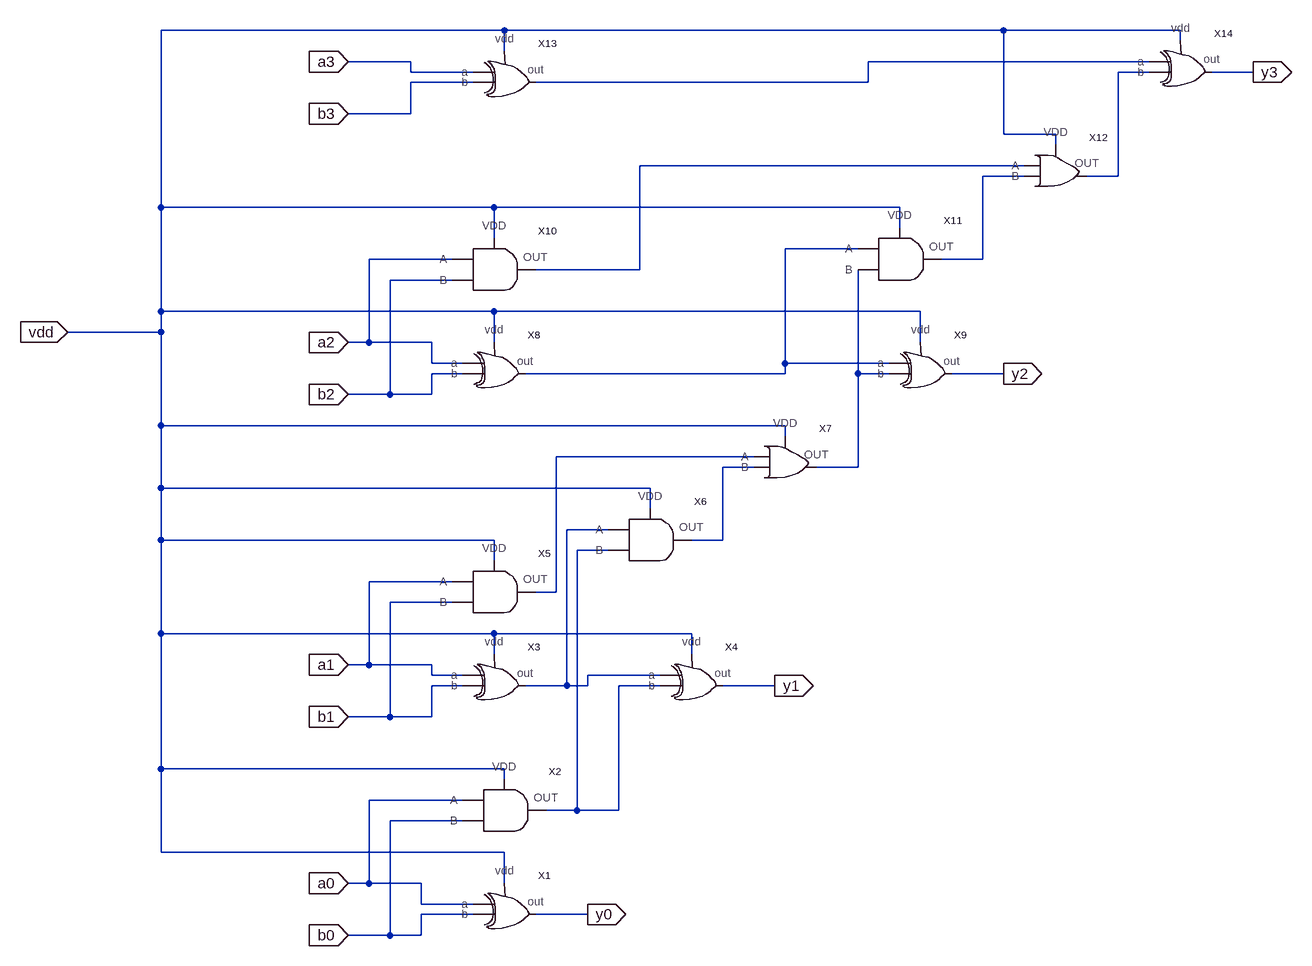
[diagram p0: schematic summer.asc]
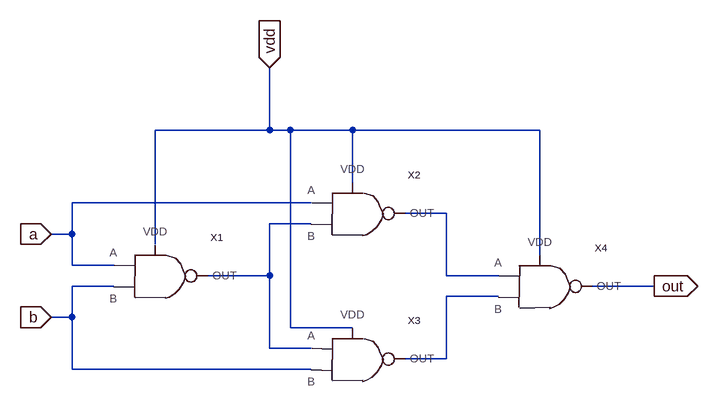
[diagram p1: sub-circuit xor.asc]
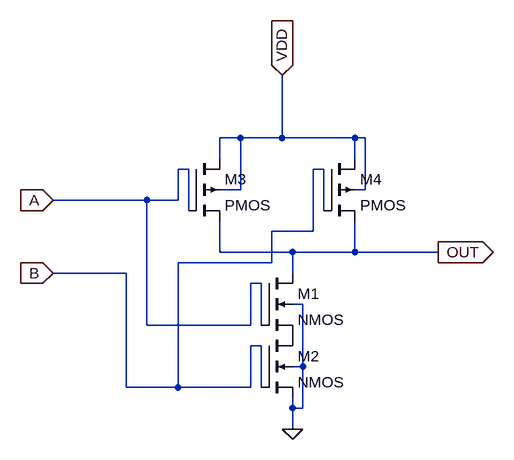
[diagram p2: sub-circuit nand.asc]
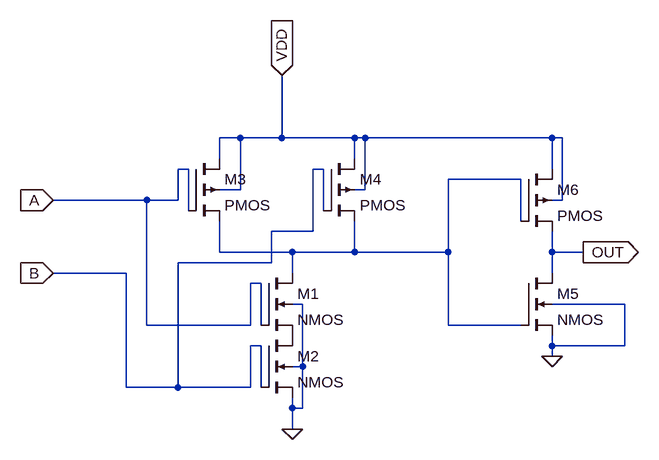
[diagram p3: sub-circuit and.asc]
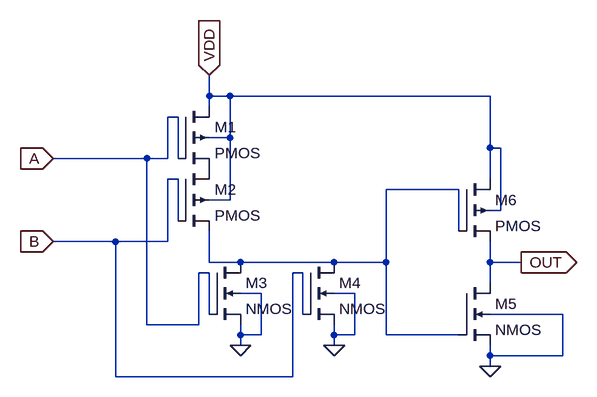
[diagram p4: sub-circuit or.asc]
summer.asc, the LTspice schematic file:
Version 4
SHEET 1 1508 680
WIRE 272 -1072 -256 -1072
WIRE 1040 -1072 272 -1072
WIRE 1312 -1072 1040 -1072
WIRE 1312 -1056 1312 -1072
WIRE 272 -1040 272 -1072
WIRE 128 -1024 32 -1024
WIRE 1264 -1024 832 -1024
WIRE 128 -1008 128 -1024
WIRE 224 -1008 128 -1008
WIRE 1264 -1008 1216 -1008
WIRE 1424 -1008 1360 -1008
WIRE 224 -992 128 -992
WIRE 832 -992 832 -1024
WIRE 832 -992 320 -992
WIRE 128 -944 128 -992
WIRE 128 -944 32 -944
WIRE 1040 -912 1040 -1072
WIRE 1120 -912 1040 -912
WIRE 1120 -896 1120 -912
WIRE 1072 -864 480 -864
WIRE 1072 -848 1008 -848
WIRE 1216 -848 1216 -1008
WIRE 1216 -848 1168 -848
WIRE -256 -800 -256 -1072
WIRE 256 -800 -256 -800
WIRE 880 -800 256 -800
WIRE 880 -768 880 -800
WIRE 256 -752 256 -800
WIRE 816 -736 704 -736
WIRE 192 -720 64 -720
WIRE 1008 -720 1008 -848
WIRE 1008 -720 944 -720
WIRE 480 -704 480 -864
WIRE 480 -704 320 -704
WIRE 192 -688 96 -688
WIRE -256 -640 -256 -800
WIRE 256 -640 -256 -640
WIRE 912 -640 256 -640
WIRE -256 -608 -256 -640
WIRE -256 -608 -400 -608
WIRE 64 -592 64 -720
WIRE 64 -592 32 -592
WIRE 160 -592 64 -592
WIRE 256 -592 256 -640
WIRE 912 -592 912 -640
WIRE 160 -560 160 -592
WIRE 208 -560 160 -560
WIRE 704 -560 704 -736
WIRE 864 -560 704 -560
WIRE 208 -544 160 -544
WIRE 704 -544 704 -560
WIRE 704 -544 304 -544
WIRE 816 -544 816 -704
WIRE 864 -544 816 -544
WIRE 1040 -544 960 -544
WIRE 96 -512 96 -688
WIRE 96 -512 32 -512
WIRE 160 -512 160 -544
WIRE 160 -512 96 -512
WIRE -256 -464 -256 -608
WIRE 704 -464 -256 -464
WIRE 704 -448 704 -464
WIRE 656 -416 352 -416
WIRE 656 -400 608 -400
WIRE 816 -400 816 -544
WIRE 816 -400 752 -400
WIRE -256 -368 -256 -464
WIRE 496 -368 -256 -368
WIRE 496 -336 496 -368
WIRE 432 -304 368 -304
WIRE -256 -288 -256 -368
WIRE 256 -288 -256 -288
WIRE 608 -288 608 -400
WIRE 608 -288 560 -288
WIRE 432 -272 384 -272
WIRE 256 -256 256 -288
WIRE 192 -224 64 -224
WIRE 352 -208 352 -416
WIRE 352 -208 320 -208
WIRE 192 -192 96 -192
WIRE -256 -144 -256 -288
WIRE 256 -144 -256 -144
WIRE 560 -144 256 -144
WIRE 256 -112 256 -144
WIRE 560 -112 560 -144
WIRE 64 -96 64 -224
WIRE 64 -96 32 -96
WIRE 160 -96 64 -96
WIRE 160 -80 160 -96
WIRE 208 -80 160 -80
WIRE 512 -80 400 -80
WIRE 208 -64 160 -64
WIRE 368 -64 368 -304
WIRE 368 -64 304 -64
WIRE 400 -64 400 -80
WIRE 400 -64 368 -64
WIRE 512 -64 448 -64
WIRE 688 -64 608 -64
WIRE 96 -16 96 -192
WIRE 96 -16 32 -16
WIRE 160 -16 160 -64
WIRE 160 -16 96 -16
WIRE -256 64 -256 -144
WIRE 272 64 -256 64
WIRE 272 80 272 64
WIRE 208 112 64 112
WIRE 384 128 384 -272
WIRE 384 128 336 128
WIRE 448 128 448 -64
WIRE 448 128 384 128
WIRE 208 144 96 144
WIRE -256 192 -256 64
WIRE 272 192 -256 192
WIRE 64 240 64 112
WIRE 64 240 32 240
WIRE 144 240 64 240
WIRE 272 240 272 192
WIRE 144 272 144 240
WIRE 224 272 144 272
WIRE 224 288 144 288
WIRE 400 288 320 288
WIRE 96 320 96 144
WIRE 96 320 32 320
WIRE 144 320 144 288
WIRE 144 320 96 320
FLAG 32 240 a0
IOPIN 32 240 In
FLAG 32 320 b0
IOPIN 32 320 In
FLAG 32 -16 b1
IOPIN 32 -16 In
FLAG 32 -96 a1
IOPIN 32 -96 In
FLAG 32 -512 b2
IOPIN 32 -512 In
FLAG 32 -592 a2
IOPIN 32 -592 In
FLAG 32 -944 b3
IOPIN 32 -944 In
FLAG 32 -1024 a3
IOPIN 32 -1024 In
FLAG 1424 -1008 y3
IOPIN 1424 -1008 Out
FLAG 1040 -544 y2
IOPIN 1040 -544 Out
FLAG 688 -64 y1
IOPIN 688 -64 Out
FLAG 400 288 y0
IOPIN 400 288 Out
FLAG -400 -608 vdd
IOPIN -400 -608 In
SYMBOL xor 272 288 R0
SYMATTR InstName X1
SYMBOL and 256 128 R0
SYMATTR InstName X2
SYMBOL xor 256 -64 R0
SYMATTR InstName X3
SYMBOL xor 560 -64 R0
SYMATTR InstName X4
SYMBOL and 240 -208 R0
SYMATTR InstName X5
SYMBOL and 480 -288 R0
SYMATTR InstName X6
SYMBOL or 720 -400 R0
SYMATTR InstName X7
SYMBOL xor 256 -544 R0
SYMATTR InstName X8
SYMBOL xor 912 -544 R0
SYMATTR InstName X9
SYMBOL and 240 -704 R0
SYMATTR InstName X10
SYMBOL and 864 -720 R0
SYMATTR InstName X11
SYMBOL or 1136 -848 R0
SYMATTR InstName X12
SYMBOL xor 272 -992 R0
SYMATTR InstName X13
SYMBOL xor 1312 -1008 R0
SYMATTR InstName X14

xor.asc, the sub-circuit schematic file:
Version 4
SHEET 1 1104 680
WIRE 416 -112 416 -208
WIRE 416 -112 240 -112
WIRE 448 -112 416 -112
WIRE 544 -112 448 -112
WIRE 832 -112 544 -112
WIRE 544 -32 544 -112
WIRE 480 0 112 0
WIRE 688 16 624 16
WIRE 480 32 416 32
WIRE 112 48 112 0
WIRE 112 48 80 48
WIRE 240 64 240 -112
WIRE 832 80 832 -112
WIRE 112 96 112 48
WIRE 176 96 112 96
WIRE 416 112 416 32
WIRE 416 112 320 112
WIRE 688 112 688 16
WIRE 768 112 688 112
WIRE 176 128 112 128
WIRE 1008 128 912 128
WIRE 768 144 688 144
WIRE 112 176 112 128
WIRE 112 176 80 176
WIRE 448 192 448 -112
WIRE 544 192 448 192
WIRE 416 224 416 112
WIRE 480 224 416 224
WIRE 688 240 688 144
WIRE 688 240 624 240
WIRE 112 256 112 176
WIRE 480 256 112 256
FLAG 80 48 a
IOPIN 80 48 In
FLAG 80 176 b
IOPIN 80 176 In
FLAG 1008 128 out
IOPIN 1008 128 Out
FLAG 416 -208 vdd
IOPIN 416 -208 In
SYMBOL nand 240 112 R0
SYMATTR InstName X1
SYMBOL nand 544 16 R0
SYMATTR InstName X2
SYMBOL nand 544 240 R0
SYMATTR InstName X3
SYMBOL nand 832 128 R0
SYMATTR InstName X4

nand.asc, the sub-circuit schematic file:
Version 4
SHEET 1 880 680
WIRE 144 -80 112 -80
WIRE 208 -80 208 -176
WIRE 208 -80 144 -80
WIRE 320 -80 208 -80
WIRE 336 -80 320 -80
WIRE 112 -48 112 -80
WIRE 320 -48 320 -80
WIRE 64 -32 48 -32
WIRE 272 -32 256 -32
WIRE 144 0 144 -80
WIRE 144 0 112 0
WIRE 336 0 336 -80
WIRE 336 0 320 0
WIRE 0 16 -144 16
WIRE 48 16 48 -32
WIRE 48 16 0 16
WIRE 64 32 64 -32
WIRE 272 32 272 -32
WIRE 256 64 256 -32
WIRE 256 64 192 64
WIRE 112 96 112 48
WIRE 224 96 112 96
WIRE 320 96 320 48
WIRE 320 96 224 96
WIRE 448 96 320 96
WIRE 192 112 192 64
WIRE 192 112 48 112
WIRE -32 128 -144 128
WIRE 224 128 224 96
WIRE 176 144 160 144
WIRE 240 176 224 176
WIRE 0 208 0 16
WIRE 160 208 160 144
WIRE 160 208 0 208
WIRE 176 208 176 144
WIRE 176 240 160 240
WIRE 240 272 240 176
WIRE 240 272 224 272
WIRE -32 304 -32 128
WIRE 48 304 48 112
WIRE 48 304 -32 304
WIRE 160 304 160 240
WIRE 160 304 48 304
WIRE 176 304 176 240
WIRE 224 336 224 320
WIRE 240 336 240 272
WIRE 240 336 224 336
WIRE 224 368 224 336
FLAG 224 368 0
FLAG 448 96 OUT
IOPIN 448 96 Out
FLAG -144 16 A
IOPIN -144 16 In
FLAG -144 128 B
IOPIN -144 128 In
FLAG 208 -176 VDD
IOPIN 208 -176 In
SYMBOL nmos4 176 128 R0
SYMATTR InstName M1
SYMATTR Value2 l=90n w=200n
SYMBOL nmos4 176 224 R0
SYMATTR InstName M2
SYMATTR Value2 l=90n w=200n
SYMBOL pmos4 64 -48 R0
SYMATTR InstName M3
SYMATTR Value2 l=90n w=400n
SYMBOL pmos4 272 -48 R0
SYMATTR InstName M4
SYMATTR Value2 l=90n w=400n

and.asc, the sub-circuit schematic file:
Version 4
SHEET 1 1116 788
WIRE 112 -32 80 -32
WIRE 176 -32 176 -128
WIRE 176 -32 112 -32
WIRE 288 -32 176 -32
WIRE 304 -32 288 -32
WIRE 592 -32 304 -32
WIRE 608 -32 592 -32
WIRE 80 0 80 -32
WIRE 288 0 288 -32
WIRE 32 16 16 16
WIRE 240 16 224 16
WIRE 592 16 592 -32
WIRE 544 32 432 32
WIRE 112 48 112 -32
WIRE 112 48 80 48
WIRE 304 48 304 -32
WIRE 304 48 288 48
WIRE -32 64 -176 64
WIRE 16 64 16 16
WIRE 16 64 -32 64
WIRE 608 64 608 -32
WIRE 608 64 592 64
WIRE 32 80 32 16
WIRE 240 80 240 16
WIRE 544 96 544 32
WIRE 224 112 224 16
WIRE 224 112 160 112
WIRE 80 144 80 96
WIRE 192 144 80 144
WIRE 288 144 288 96
WIRE 288 144 192 144
WIRE 432 144 432 32
WIRE 432 144 288 144
WIRE 592 144 592 112
WIRE 640 144 592 144
WIRE 160 160 160 112
WIRE 160 160 16 160
WIRE -64 176 -176 176
WIRE 192 176 192 144
WIRE 592 176 592 144
WIRE 144 192 128 192
WIRE 208 224 192 224
WIRE 704 224 592 224
WIRE -32 256 -32 64
WIRE 128 256 128 192
WIRE 128 256 -32 256
WIRE 144 256 144 192
WIRE 432 256 432 144
WIRE 544 256 432 256
WIRE 144 288 128 288
WIRE 592 288 592 272
WIRE 704 288 704 224
WIRE 704 288 592 288
WIRE 592 304 592 288
WIRE 208 320 208 224
WIRE 208 320 192 320
WIRE -64 352 -64 176
WIRE 16 352 16 160
WIRE 16 352 -64 352
WIRE 128 352 128 288
WIRE 128 352 16 352
WIRE 144 352 144 288
WIRE 192 384 192 368
WIRE 208 384 208 320
WIRE 208 384 192 384
WIRE 192 416 192 384
FLAG 192 416 0
FLAG -176 64 A
IOPIN -176 64 In
FLAG -176 176 B
IOPIN -176 176 In
FLAG 176 -128 VDD
IOPIN 176 -128 In
FLAG 592 304 0
FLAG 640 144 OUT
IOPIN 640 144 Out
SYMBOL nmos4 144 176 R0
SYMATTR InstName M1
SYMATTR Value2 l=90n w=200n
SYMBOL nmos4 144 272 R0
SYMATTR InstName M2
SYMATTR Value2 l=90n w=200n
SYMBOL pmos4 32 0 R0
SYMATTR InstName M3
SYMATTR Value2 l=90n w=400n
SYMBOL pmos4 240 0 R0
SYMATTR InstName M4
SYMATTR Value2 l=90n w=400n
SYMBOL nmos4 544 176 R0
SYMATTR Value2 l=90n w=200n
SYMATTR InstName M5
SYMBOL pmos4 544 16 R0
SYMATTR Value2 l=90n w=400n
SYMATTR InstName M6

or.asc, the sub-circuit schematic file:
Version 4
SHEET 1 1084 680
WIRE 32 -32 32 -64
WIRE 64 -32 32 -32
WIRE 464 -32 64 -32
WIRE 32 -16 32 -32
WIRE -16 0 -32 0
WIRE 64 32 64 -32
WIRE 64 32 32 32
WIRE 464 48 464 -32
WIRE 480 48 464 48
WIRE -64 64 -208 64
WIRE -32 64 -32 0
WIRE -32 64 -64 64
WIRE -16 64 -16 0
WIRE -16 96 -32 96
WIRE 464 96 464 48
WIRE 416 112 304 112
WIRE 64 128 64 32
WIRE 64 128 32 128
WIRE 480 144 480 48
WIRE 480 144 464 144
WIRE -16 160 -16 96
WIRE 416 176 416 112
WIRE -112 192 -208 192
WIRE -32 192 -32 96
WIRE -32 192 -112 192
WIRE 32 224 32 176
WIRE 80 224 32 224
WIRE 224 224 80 224
WIRE 304 224 304 112
WIRE 304 224 224 224
WIRE 464 224 464 192
WIRE 512 224 464 224
WIRE 32 240 16 240
WIRE 176 240 160 240
WIRE 464 256 464 224
WIRE 112 272 80 272
WIRE 256 272 224 272
WIRE 32 304 32 240
WIRE 176 304 176 240
WIRE 576 304 464 304
WIRE -64 320 -64 64
WIRE 16 320 16 240
WIRE 16 320 -64 320
WIRE 80 336 80 320
WIRE 112 336 112 272
WIRE 112 336 80 336
WIRE 224 336 224 320
WIRE 256 336 256 272
WIRE 256 336 224 336
WIRE 304 336 304 224
WIRE 416 336 304 336
WIRE 80 352 80 336
WIRE 224 352 224 336
WIRE 464 368 464 352
WIRE 576 368 576 304
WIRE 576 368 464 368
WIRE 464 384 464 368
WIRE -112 400 -112 192
WIRE 160 400 160 240
WIRE 160 400 -112 400
FLAG 32 -64 VDD
IOPIN 32 -64 In
FLAG 80 352 0
FLAG 224 352 0
FLAG -208 64 A
IOPIN -208 64 In
FLAG -208 192 B
IOPIN -208 192 In
FLAG 464 384 0
FLAG 512 224 OUT
IOPIN 512 224 Out
SYMBOL pmos4 -16 -16 R0
SYMATTR InstName M1
SYMATTR Value2 l=90n w=400n
SYMBOL pmos4 -16 80 R0
SYMATTR InstName M2
SYMATTR Value2 l=90n w=400n
SYMBOL nmos4 32 224 R0
SYMATTR InstName M3
SYMATTR Value2 l=90n w=200n
SYMBOL nmos4 176 224 R0
SYMATTR InstName M4
SYMATTR Value2 l=90n w=200n
SYMBOL nmos4 416 256 R0
SYMATTR Value2 l=90n w=200n
SYMATTR InstName M5
SYMBOL pmos4 416 96 R0
SYMATTR Value2 l=90n w=400n
SYMATTR InstName M6

The netlist it stands for:
* summer.asc
XX1 a0 b0 vdd y0 xor
XX2 vdd a0 b0 N010 and
XX3 a1 b1 vdd N009 xor
XX4 N009 N010 vdd y1 xor
XX5 vdd a1 b1 N007 and
XX6 vdd N009 N010 N008 and
XX7 N007 N008 vdd N006 or
XX8 a2 b2 vdd N005 xor
XX9 N005 N006 vdd y2 xor
XX10 vdd a2 b2 N003 and
XX11 vdd N005 N006 N004 and
XX12 N003 N004 vdd N002 or
XX13 a3 b3 vdd N001 xor
XX14 N001 N002 vdd y3 xor

* block symbol definitions
.subckt xor a b vdd out
XX1 a b N002 vdd nand
XX2 a N002 N001 vdd nand
XX3 N002 b N003 vdd nand
XX4 N001 N003 out vdd nand
.ends xor

.subckt nand A B OUT VDD
M1 OUT A P001 0 NMOS l=90n w=200n
M2 P001 B 0 0 NMOS l=90n w=200n
M3 VDD A OUT VDD PMOS l=90n w=400n
M4 VDD B OUT VDD PMOS l=90n w=400n
.ends nand

.subckt and VDD A B OUT
M1 N001 A P001 0 NMOS l=90n w=200n
M2 P001 B 0 0 NMOS l=90n w=200n
M3 VDD A N001 VDD PMOS l=90n w=400n
M4 VDD B N001 VDD PMOS l=90n w=400n
M5 OUT N001 0 0 NMOS l=90n w=200n
M6 VDD N001 OUT VDD PMOS l=90n w=400n
.ends and

.subckt or A B VDD OUT
M1 VDD A P001 VDD PMOS l=90n w=400n
M2 P001 B N001 VDD PMOS l=90n w=400n
M3 N001 A 0 0 NMOS l=90n w=200n
M4 N001 B 0 0 NMOS l=90n w=200n
M5 OUT N001 0 0 NMOS l=90n w=200n
M6 VDD N001 OUT VDD PMOS l=90n w=400n
.ends or

.model NMOS NMOS
.model PMOS PMOS
.lib standard.mos
.backanno
.end